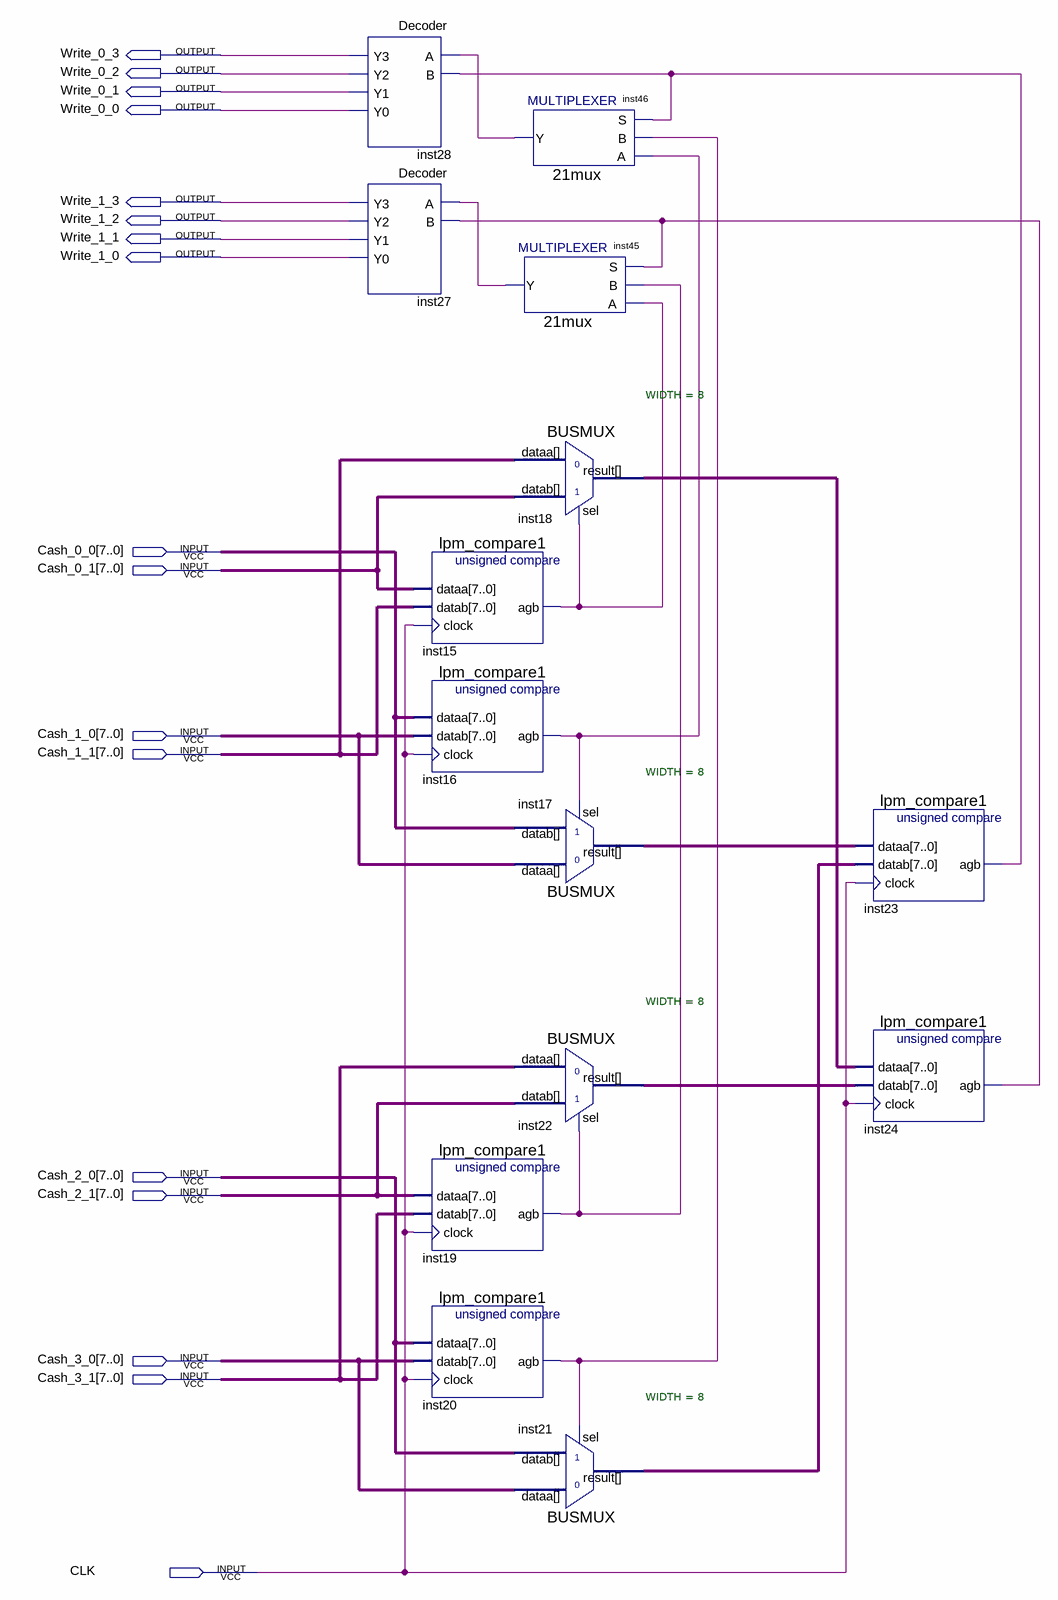
[diagram p0: schematic sheet]
// Quartus schematic Comporator.bdf as structural Verilog: 14 symbols, 17 pins
module Comporator (
  input  [7:0] Cash_0_0,
  input  [7:0] Cash_0_1,
  input  [7:0] Cash_1_0,
  input  [7:0] Cash_1_1,
  input  [7:0] Cash_2_0,
  input  [7:0] Cash_2_1,
  input  [7:0] Cash_3_0,
  input  [7:0] Cash_3_1,
  input  CLK,
  output Write_0_3,
  output Write_0_2,
  output Write_0_1,
  output Write_0_0,
  output Write_1_3,
  output Write_1_2,
  output Write_1_1,
  output Write_1_0
);

  wire inst15_agb, inst16_agb, inst19_agb, inst20_agb, inst23_agb, inst24_agb, inst45_y, inst46_y;
  wire [7:0] inst17_result, inst18_result, inst21_result, inst22_result;

  Decoder inst28 (.A(inst46_y), .B(inst23_agb), .Y3(Write_0_3), .Y2(Write_0_2), .Y1(Write_0_1), .Y0(Write_0_0));
  Decoder inst27 (.A(inst45_y), .B(inst24_agb), .Y3(Write_1_3), .Y2(Write_1_2), .Y1(Write_1_1), .Y0(Write_1_0));
  lpm_compare1 inst15 (.dataa(Cash_0_1), .datab(Cash_1_1), .clock(CLK), .agb(inst15_agb));
  lpm_compare1 inst16 (.dataa(Cash_0_0), .datab(Cash_1_0), .clock(CLK), .agb(inst16_agb));
  lpm_compare1 inst19 (.dataa(Cash_2_1), .datab(Cash_3_1), .clock(CLK), .agb(inst19_agb));
  lpm_compare1 inst20 (.dataa(Cash_2_0), .datab(Cash_3_0), .clock(CLK), .agb(inst20_agb));
  \21mux  inst46 (.S(inst23_agb), .B(inst20_agb), .A(inst16_agb), .Y(inst46_y));
  \21mux  inst45 (.S(inst24_agb), .B(inst19_agb), .A(inst15_agb), .Y(inst45_y));
  BUSMUX #(.WIDTH(8)) inst18 (.datab(Cash_0_1), .sel(inst15_agb), .dataa(Cash_1_1), .result(inst18_result));
  BUSMUX #(.WIDTH(8)) inst17 (.datab(Cash_0_0), .sel(inst16_agb), .dataa(Cash_1_0), .result(inst17_result));
  BUSMUX #(.WIDTH(8)) inst22 (.datab(Cash_2_1), .sel(inst19_agb), .dataa(Cash_3_1), .result(inst22_result));
  BUSMUX #(.WIDTH(8)) inst21 (.datab(Cash_2_0), .sel(inst20_agb), .dataa(Cash_3_0), .result(inst21_result));
  lpm_compare1 inst23 (.dataa(inst17_result), .datab(inst21_result), .clock(CLK), .agb(inst23_agb));
  lpm_compare1 inst24 (.dataa(inst18_result), .datab(inst22_result), .clock(CLK), .agb(inst24_agb));
endmodule
